# EAGLE design TinyBattery(I2C_V2) (EAGLE 6.5.0)
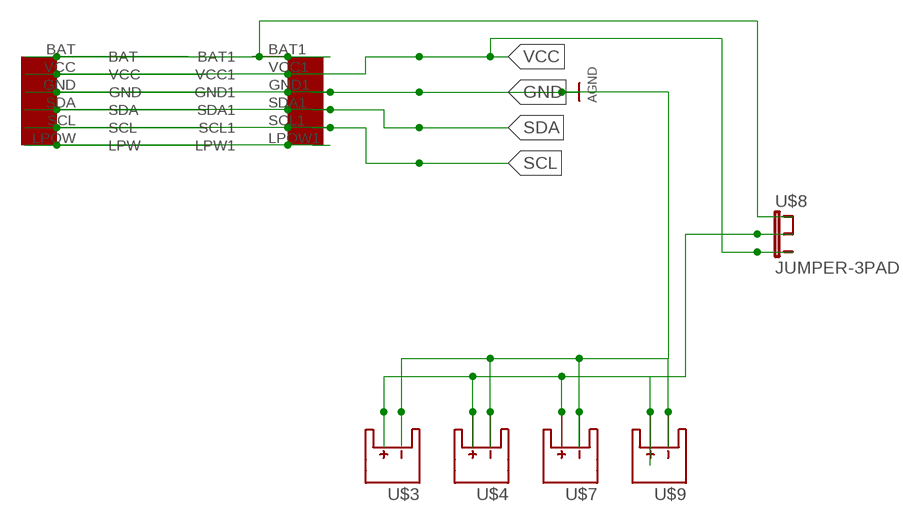
[diagram p0: schematic, sheet 1]

## Parts
U$1  EZ-I2CHEADERV1  [EZ-I2CHEADERV1]
U$3  BATTERY_1.25MM_PINHOLES  [BATTERY_1.25MM_PINHOLES]
U$4  BATTERY_1.25MM_PINHOLES  [BATTERY_1.25MM_PINHOLES]
U$7  BATTERY_1.25MM_PINHOLES  [BATTERY_1.25MM_PINHOLES]
U$8  JUMPER-3PAD  [JUMPER-3PAD]
U$9  BATTERY_1.25MM_PINHOLES  [BATTERY_1.25MM_PINHOLES]

## Nets
BAT: U$1.BAT U$1.BAT1 U$8.1
GND: U$1.GND U$1.GND1 U$3.- U$4.- U$7.- U$9.- ; supply symbol labelled AGND
N$1: U$3.+ U$4.+ U$7.+ U$8.2 U$9.+
N$3: U$1.LPOW1(LPW1) U$1.LPOW(LPW)
SCL: U$1.SCL U$1.SCL1
SDA: U$1.SDA U$1.SDA1
VCC: U$1.VCC U$1.VCC1 U$8.3

## Library data of the parts
U$1 = UniqueInteractionsLib:EZ-I2CHEADERV1
U$3 U$4 U$7 U$9 = UniqueInteractionsLib:BATTERY_1.25MM_PINHOLES
U$8 = UniqueInteractionsLib:JUMPER-3PAD

## Board
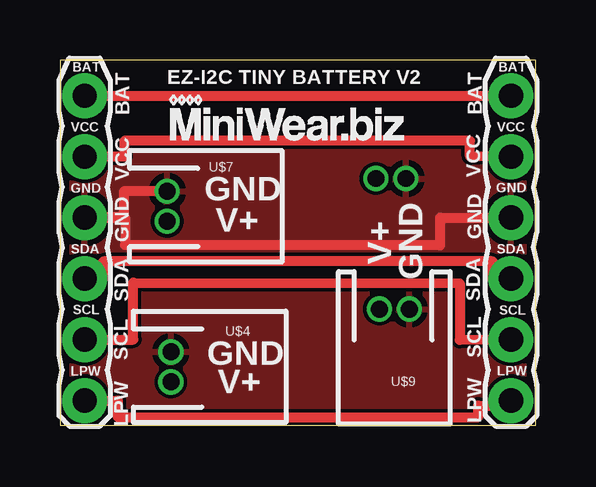
[diagram p1: board, top side]
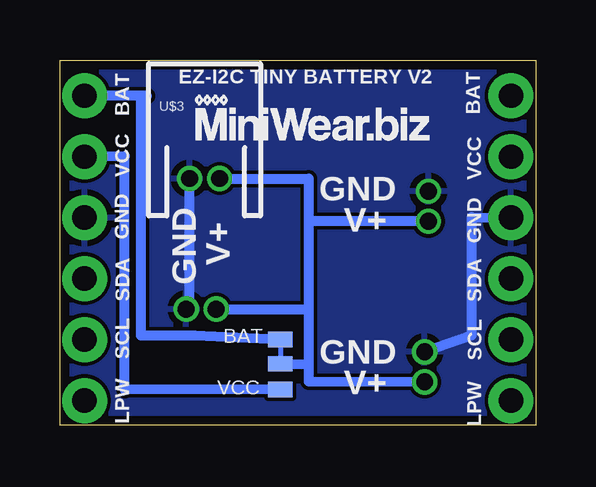
[diagram p2: board, bottom side, seen from below]

Size 19.83 x 15.21 mm. Coordinates in mm from the lower left corner, seen from the top.
Outline: 0,0 19.83,0 19.83,15.21 0,15.19 0,0
Copper layers (1*16): Top 0.0356mm / dielectric 1.5011mm / Bottom 0.0356mm
Design rules "oshParkPCBDesignRules": minimum track width 6mil, minimum drill 13mil, track to track 6mil, track to pad 6mil, pad to pad 6mil, via to via 6mil, smd to smd 6mil, copper to edge 15mil, drill to drill 6mil, minimum pad ring 7mil, minimum via ring 7mil, stop-mask expansion 3mil, vias tented up to drill 0mil, thermal gap 10mil

### Footprints (pad centres in the part's own frame; a part is rotated, then mirrored left to right if it is on the bottom)
EZ-I2CHEADERV1 = drill 1.016 pad 1.88: BAT 0,-1.27; BAT1 17.78,-1.27; GND 0,-6.35; GND1 17.78,-6.35; LPOW 0,-13.97; LPOW1 17.78,-13.97; SCL 0,-11.43; SCL1 17.78,-11.43; SDA 0,-8.89; SDA1 17.78,-8.89; VCC 0,-3.81; VCC1 17.78,-3.81
BATTERY_1.25MM_PINHOLES = drill 0.7 pad 1.016: + 1.25,0; - 0,0
JUMPER-3PAD = smd 0.635 x 1.016: 1 -0.508,0; 2 0.508,0; 3 1.578,0

### Placement (x,y rotation side)
U$1  1.03,14.99 0 top
U$2  [LOGO2]  14.29,11.68 0 bottom
U$3  14.43,10.27 0 bottom
U$4  4.63,3.05 270 top
U$6  [LOGO2]  4.48,11.68 0 top
U$7  4.47,9.74 270 top
U$8  10.64,3.06 270 bottom
U$9  14.57,4.83 180 top

### Tracks (layer width: path | path; a pad name or v marks a point on that pad's centre or on a via)
BAT
  Top 0.406: U$1.BAT U$1.BAT1
  Bottom 0.406: 16.47,13.72 U$1.BAT1 | 16.21,13.72 16.47,13.72 | 16.47,13.72 16.47,3.74 14.21,3.74 U$8.1
GND
  Top 0.406: U$1.GND 2.71,8.64 2.71,7.51 15.85,7.51 | U$1.GND1 15.85,8.64 15.85,7.51 | 2.49,8.66 1.03,8.66 U$1.GND | U$7.- 2.66,9.74 2.66,8.66 1.03,8.66 U$1.GND | 15.85,7.51 15.85,7.48
  Bottom 0.406: U$1.GND 2.66,8.66 2.66,3.74 U$4.- | U$9.- 14.43,4.83 U$3.-
  pour Top: -1.94,17.15 21.85,17.22 21.76,-1.2 -2.1,-1.04
  pour Bottom: -3.09,-1.08 24.72,-0.76 24.82,17.13 -2.85,17.14
N$1
  Bottom 0.406: U$8.2 9.47,2.53 | 9.47,2.53 9.47,1.82 U$4.+ | U$3.+ 9.47,10.27 9.47,8.49 | 9.47,8.49 9.47,4.83 | 9.47,2.53 9.47,4.74 9.47,4.83 | U$7.+ 9.47,8.49 | U$9.+ 9.47,4.83
N$3
  Top 0.406: U$1.LPOW 2.41,1.02 2.41,0.33 17.44,0.33 17.44,0.81 18.81,0.81 U$1.LPOW1
SCL
  Top 0.406: U$1.SCL 3.06,3.56 3.06,5.93 16.67,5.9 16.67,3.55 18.81,3.58 U$1.SCL1
SDA
  Top 0.406: U$1.SDA1 18.04,6.05 18.04,6.82 1.82,6.82 1.82,6.1 U$1.SDA
VCC
  Top 0.406: U$1.VCC1 17.1,11.19 17.1,11.84 2.68,11.84 2.68,11.18 U$1.VCC
  Bottom 0.406: U$1.VCC1 17.13,11.2 17.13,1.46 U$8.3

### Text on the board
tNames: EZ-I2C TINY BATTERY V2 | GND | V+ | V+ | GND | GND | V+
bNames: EZ-I2C TINY BATTERY V2 | GND | V+ | V+ | GND | BAT | GND | V+ | VCC